# Altium project 28112023.PrjPcb
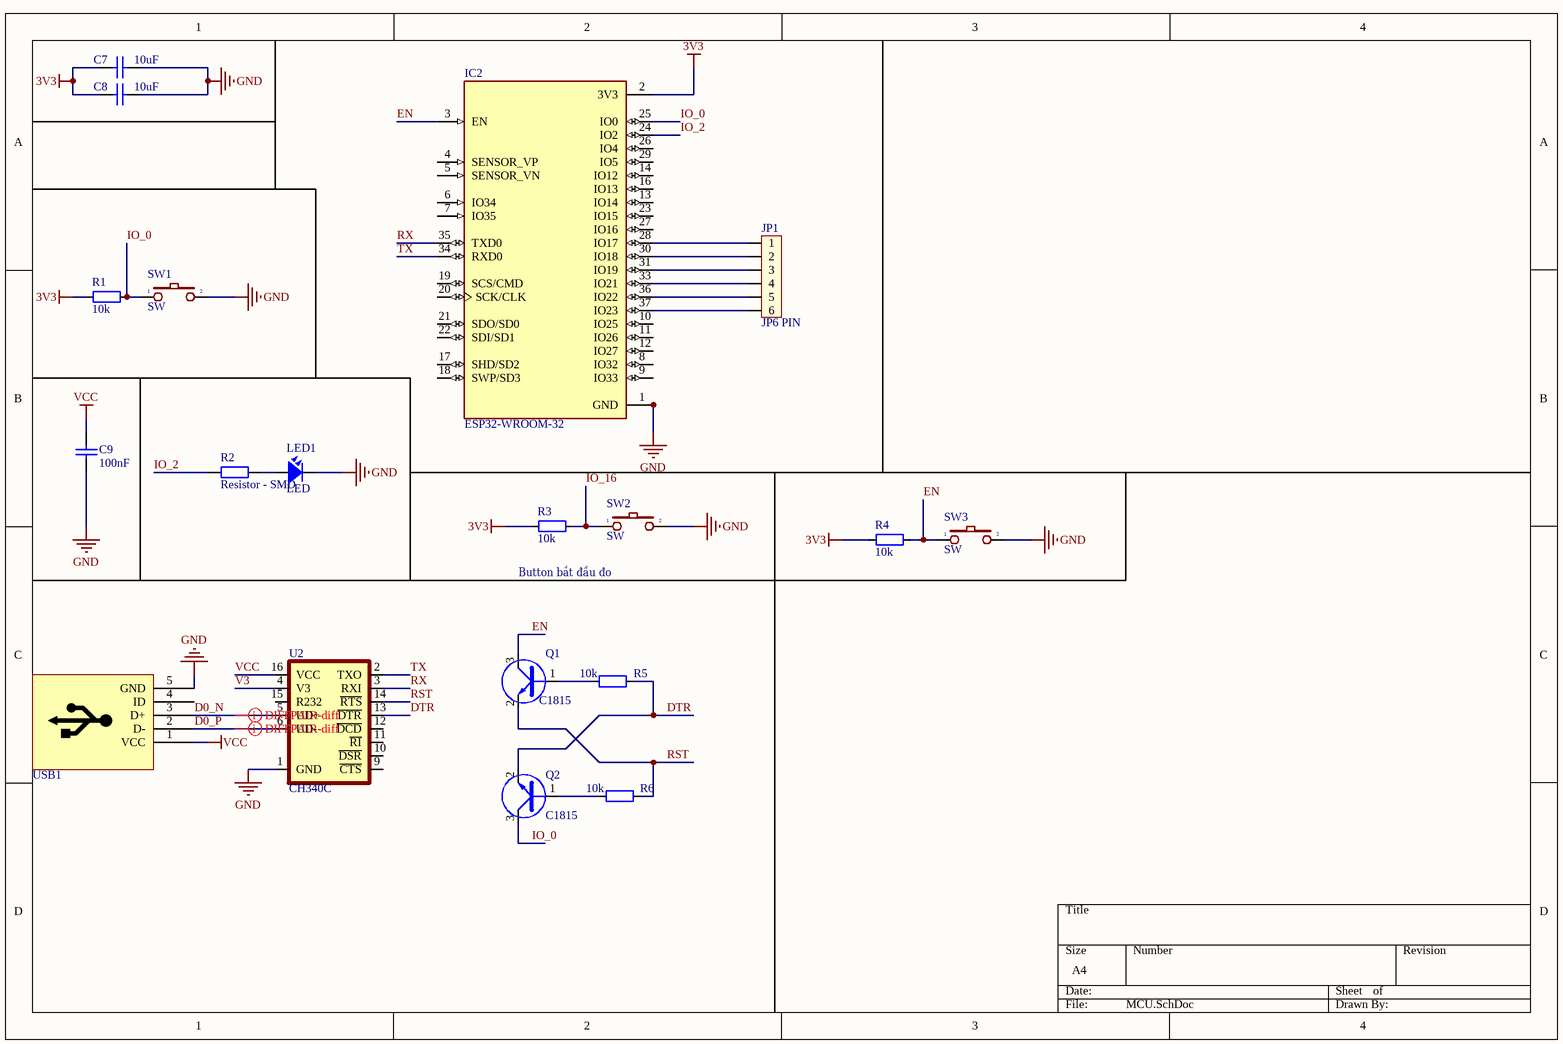
[diagram p0: MCU.SchDoc]
1 sheet, 19 parts. Net scope: global (net labels, ports and power ports of the same name join across sheets).
Board file: POWER.PcbDoc

## Sheet MCU.SchDoc
size A4; SheetNumber: 1; SheetTotal: 2

### Parts
C7  10uF  [C0805]
C8  10uF  [C0805]
C9  100nF  [C0805]
IC2  ESP32-WROOM-32  [MODULE_ESP32-WROOM-32]
JP1  JP6 PIN  [JP6]
LED1  LED  [LED0805]
Q1  C1815  [SOT23D]
Q2  C1815  [SOT23D]
R1  10k  [RES-SMD-0805]
R2  Resistor - SMD  [RES-SMD-0805]
R3  10k  [RES-SMD-0805]
R4  10k  [RES-SMD-0805]
R5  10k  [RES-SMD-0805]
R6  10k  [RES-SMD-0805]
SW1  SW  [SW2]
SW2  SW  [SW2]
SW3  SW  [SW2]
U2  CH340C  [SOP-16]
USB1  USB  [USB-M1]  (value not drawn)

### Nets
3V3: C7.1 C8.1 IC2.2(3V3) R1.2 R3.2 R4.2
GND: C7.2 C8.2 C9.1 IC2.1(GND) IC2.15(GND) IC2.38(GND) IC2.39_1(GND) IC2.39_2(GND) IC2.39_3(GND) IC2.39_4(GND) IC2.39_5(GND) IC2.39_6(GND) IC2.39_7(GND) IC2.39_8(GND) IC2.39_9(GND) IC2.39_10(GND) IC2.39_11(GND) IC2.39_12(GND) IC2.39_13(GND) IC2.39_14(GND) IC2.39_15(GND) IC2.39_16(GND) IC2.39_17(GND) IC2.39_18(GND) IC2.39_19(GND) IC2.39_20(GND) IC2.39_21(GND) LED1.2 SW1.2 SW2.2 SW3.2 U2.1(GND) USB1.5(GND)
VCC: C9.2 U2.16(VCC) USB1.1(VCC)
D0_N: U2.5(UD+) USB1.3(D+)
D0_P: U2.6(UD-) USB1.2(D-)
DTR: Q2.2(E) R5.1 U2.13(~{DTR})
EN: IC2.3(EN) Q1.3(C) R4.1 SW3.1
IO_0: IC2.25(IO0) Q2.3(C) R1.1 SW1.1
IO_2: IC2.24(IO2) R2.2
IO_16: R3.1 SW2.1
RST: Q1.2(E) R6.1 U2.14(~{RTS})
RX: IC2.35(TXD0) U2.3(RXI)
TX: IC2.34(RXD0) U2.2(TXO)
V3: U2.4(V3)
NetIC2_28: IC2.28(IO17) JP1.1
NetIC2_30: IC2.30(IO18) JP1.2
NetIC2_31: IC2.31(IO19) JP1.3
NetIC2_33: IC2.33(IO21) JP1.4
NetIC2_36: IC2.36(IO22) JP1.5
NetIC2_37: IC2.37(IO23) JP1.6
NetLED1_1: LED1.1 R2.1
NetQ1_1: Q1.1(B) R5.2
NetQ2_1: Q2.1(B) R6.2

Not connected (* = marked no-connect by the designer): IC2 4(SENSOR_VP) 5(SENSOR_VN) 6(IO34) 7(IO35) 8(IO32) 9(IO33) 10(IO25) 11(IO26) 12(IO27) 13(IO14) 14(IO12) 16(IO13) 17(SHD/SD2) 18(SWP/SD3) 19(SCS/CMD) 20(SCK/CLK) 21(SDO/SD0) 22(SDI/SD1) 23(IO15) 26(IO4) 27(IO16) 29(IO5); U2 9(~{CTS}) 10(~{DSR}) 11(~{RI}) 12(~{DCD}) 15(R232); USB1 4(ID)

### Layout directives
differential pair; differential pair class diff: D0_N, D0_P

### Notes on the sheet
- Button bắt đầu đo

### Library data of the parts
C7-C9 = CapSMD: Capacitor; Value: 33p; Published: 8-Jun-2000; LatestRevisionDate: 17-Jul-2002; LatestRevisionNote: Re-released for DXP Platform.; PackageReference: RAD-0.3; Publisher: Altium Limited
IC2 = ESP32-WROOM-32: Bluetooth, WiFi Transceiver Module 2.4GHz ~ 2.5GHz Surface Mount; MF: Espressif Systems; Package: Module Espressif Systems; Digi-Key_Part_Number: 1904-1010-1-ND; Digi-Key_Purchase_URL: https://www.digikey.com/product-detail/en/espressif-systems/ESP32-WROOM-32/1904-1010-1-ND/8544305?utm_source=snapeda&utm_medium=aggregator&utm_campaign=symbol; Value: *; MP: ESP32-WROOM-32; SnapEDA_Link: https://www.snapeda.com/parts/ESP32-WROOM-32/Espressif%20Systems/view-part/2753322/?ref=snap
JP1 = JP6: Value: JP7
LED1 = LED: LED Single colour Green and Red; Value: LED 3 ly Single Colour
Q1 Q2 = 2SC1815: NPN 600mW, ECB; Value: C1815
R1 R3-R6 = Resistor - SMD: Resistor; Manufacturer: Generic Components; Class: Passive; Published: 08/06/2000; Publisher: Altium Hobart Technology Centre
R2 = Resistor - SMD: Resistor SMD; Manufacturer: Generic Components; Class: Passive; Published: 08/06/2000; Publisher: Altium Hobart Technology Centre
SW1-SW3 = SW2: Switch button 2 pin; Value: SW chip 2 pin
U2 = CH340C: USB to serial chip CH340; MF: WCH; Package: Package; Check_prices: https://www.snapeda.com/parts/CH340C/WCH/view-part/5428851/?ref=eda; Value: *; Price: None; MP: CH340C; Availability: Unavailable; SnapEDA_Link: https://www.snapeda.com/parts/CH340C/WCH/view-part/5428851/?ref=snap
USB1 = USB-M